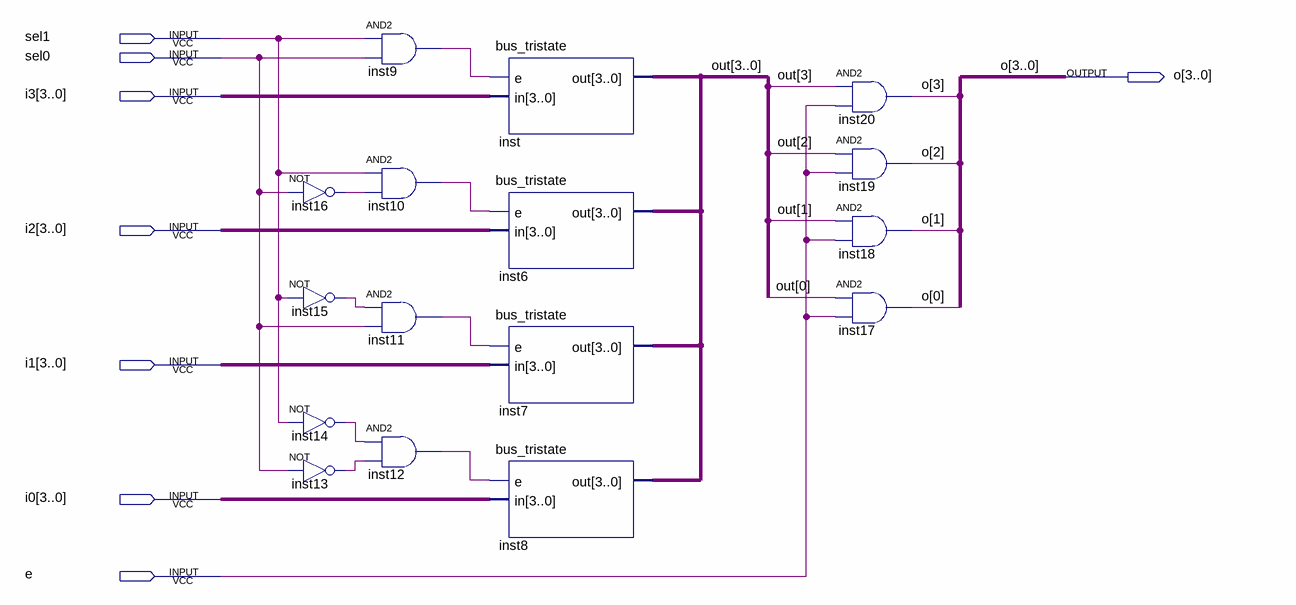
[diagram p0: schematic sheet]
// Quartus schematic mux16x4.bdf as structural Verilog: 16 symbols, 8 pins
module mux16x4 (
  input  sel1,
  input  sel0,
  input  [3:0] i3,
  input  [3:0] i2,
  input  [3:0] i1,
  input  [3:0] i0,
  input  e,
  output [3:0] o
);

  wire inst9_out, inst10_out, inst11_out, inst12_out, inst13_out, inst14_out, inst15_out, inst16_out;
  wire [3:0] out;

  not inst16 (inst16_out, sel0);
  not inst15 (inst15_out, sel1);
  not inst14 (inst14_out, sel1);
  not inst13 (inst13_out, sel0);
  and inst9 (inst9_out, sel1, sel0);
  and inst10 (inst10_out, sel1, inst16_out);
  and inst11 (inst11_out, inst15_out, sel0);
  and inst12 (inst12_out, inst14_out, inst13_out);
  bus_tristate inst (.e(inst9_out), .in(i3), .out(out));
  bus_tristate inst6 (.e(inst10_out), .in(i2), .out(out));
  bus_tristate inst7 (.e(inst11_out), .in(i1), .out(out));
  bus_tristate inst8 (.e(inst12_out), .in(i0), .out(out));
  and inst20 (o[3], out[3], e);
  and inst19 (o[2], out[2], e);
  and inst18 (o[1], out[1], e);
  and inst17 (o[0], out[0], e);
endmodule
